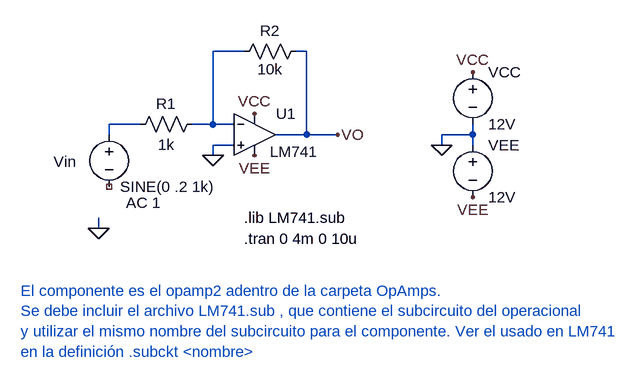
[diagram p0: schematic operacional.asc]
operacional.asc, the LTspice schematic file:
Version 4
SHEET 1 1856 680
WIRE 144 16 96 16
WIRE 240 16 224 16
WIRE -16 128 -64 128
WIRE 96 128 96 16
WIRE 96 128 64 128
WIRE 128 128 96 128
WIRE -64 144 -64 128
WIRE 240 144 240 16
WIRE 240 144 192 144
WIRE 288 144 240 144
WIRE 496 144 496 128
WIRE 496 144 448 144
WIRE 128 160 96 160
WIRE 448 160 448 144
WIRE 496 160 496 144
WIRE 96 176 96 160
WIRE -80 288 -80 272
FLAG -80 288 0
FLAG 160 112 VCC
FLAG 160 176 VEE
FLAG 288 144 VO
FLAG 448 160 0
FLAG 496 48 VCC
FLAG 496 240 VEE
FLAG 96 176 0
SYMBOL opamp2 160 80 R0
WINDOW 0 33 32 Left 2
WINDOW 3 24 90 Left 2
SYMATTR InstName U1
SYMATTR Value LM741
SYMBOL voltage -64 128 R0
WINDOW 123 26 121 Left 2
WINDOW 39 0 0 Left 2
WINDOW 0 -85 58 Left 2
WINDOW 3 17 96 Left 2
SYMATTR Value2 AC 1
SYMATTR InstName Vin
SYMATTR Value SINE(0 .2 1k)
SYMBOL res 80 112 R90
WINDOW 0 0 56 VBottom 2
WINDOW 3 32 56 VTop 2
SYMATTR InstName R1
SYMATTR Value 1k
SYMBOL res 240 0 R90
WINDOW 0 0 56 VBottom 2
WINDOW 3 28 56 VTop 2
SYMATTR InstName R2
SYMATTR Value 10k
SYMBOL voltage 496 32 R0
SYMATTR InstName VCC
SYMATTR Value 12V
SYMBOL voltage 496 144 R0
SYMATTR InstName VEE
SYMATTR Value 12V
TEXT 144 272 Left 2 !.lib LM741.sub
TEXT 144 304 Left 2 !.tran 0 4m 0 10u
TEXT -200 384 Left 2 ;El componente es el opamp2 adentro de la carpeta OpAmps.\nSe debe incluir el archivo LM741.sub , que contiene el subcircuito del operacional \ny utilizar el mismo nombre del subcircuito para el componente. Ver el usado en LM741\nen la definición .subckt <nombre>

The netlist it stands for:
* operacional.asc
XU1 0 N001 VCC VEE VO LM741  ; pins In+ In- V+ V- OUT
Vin N002 NC_01 SINE(0 .2 1k) AC 1
R1 N001 N002 1k
R2 VO N001 10k
VCC VCC 0 12V
VEE 0 VEE 12V
.lib LM741.sub
.tran 0 4m 0 10u
* El componente es el opamp2 adentro de la carpeta OpAmps.
* Se debe incluir el archivo LM741.sub , que contiene el subcircuito del operacional
* y utilizar el mismo nombre del subcircuito para el componente. Ver el usado en LM741
* en la definición .subckt <nombre>
.backanno
.end